# EAGLE design teensy_sid (EAGLE 8.1.0)
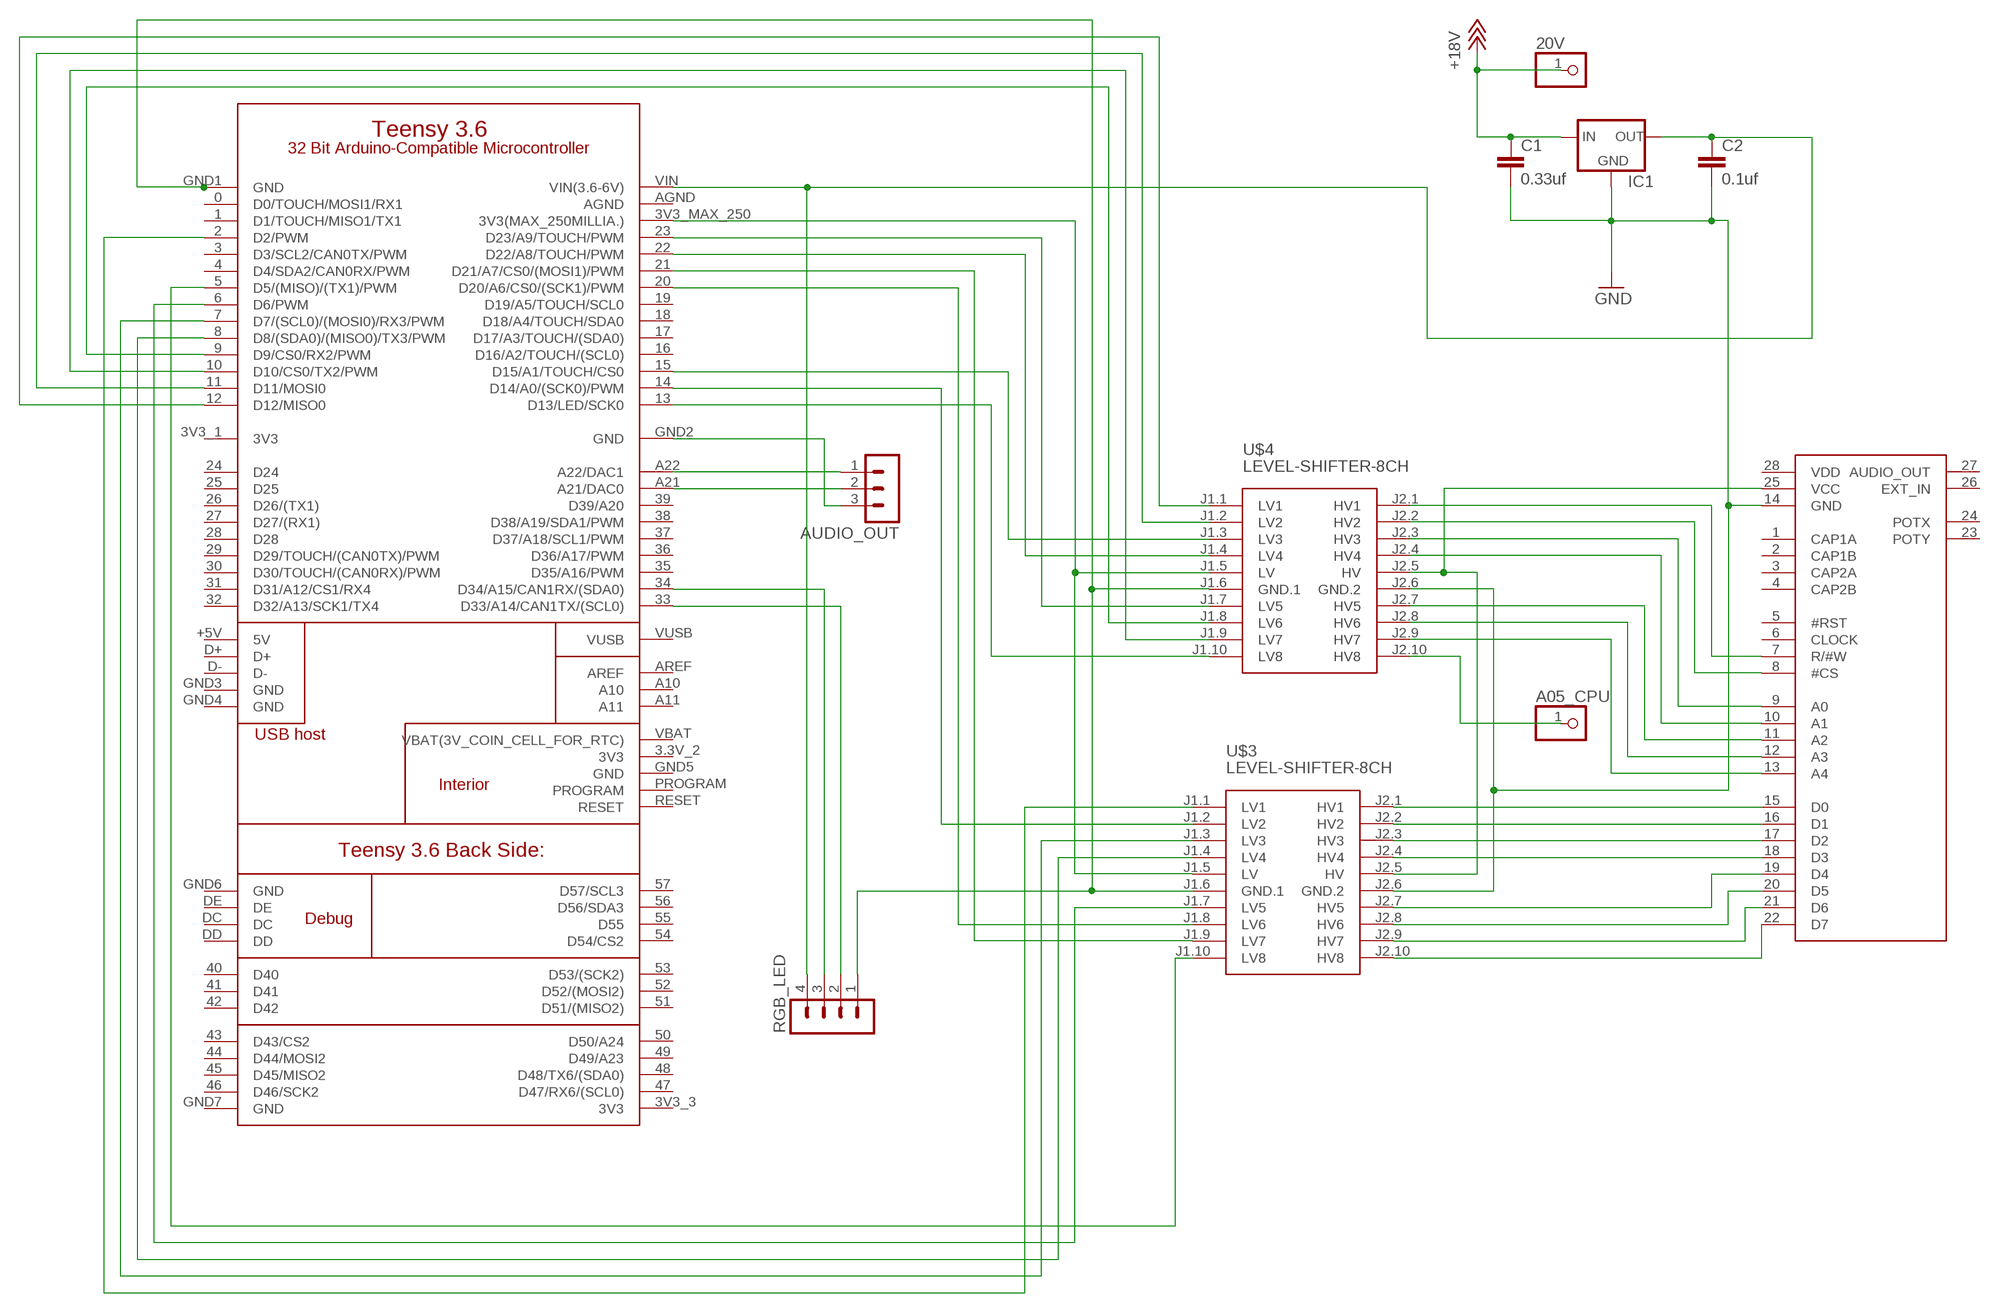
[diagram p0: schematic, sheet 1]

## Parts
20V  PINHD-1X1  [1X01]
A05_CPU  PINHD-1X1  [1X01]
AUDIO_OUT  MA03-1  [MA03-1]
C1  0.33uf  C-EU025-024X044  [C025-024X044]
C2  0.1uf  C-EU025-024X044  [C025-024X044]
IC1  78XXL  [78XXL]
RGB_LED  MA04-1  [MA04-1]
U$1  SID_6581  [DIL28-6]
U$2  TEENSY-3.6_FULL  [TEENSY-3.6_FULL]
U$3  LEVEL-SHIFTER-8CH  [LEVEL-SHIFTER-8CH]
U$4  LEVEL-SHIFTER-8CH  [LEVEL-SHIFTER-8CH]

## Nets
+18V: 20V.1 C1.1 IC1.IN
A0: U$1.9(A0) U$4.J2.3(HV3)
A1: U$1.10(A1) U$4.J2.4(HV4)
A2: U$1.11(A2) U$4.J2.7(HV5)
A3: U$1.12(A3) U$4.J2.8(HV6)
A4: U$1.13(A4) U$4.J2.9(HV7)
CS#: U$1.8(#CS) U$4.J2.2(HV2)
D0: U$1.15(D0) U$3.J2.1(HV1)
D1: U$1.16(D1) U$3.J2.2(HV2)
D2: U$1.17(D2) U$3.J2.3(HV3)
D3: U$1.18(D3) U$3.J2.4(HV4)
D4: U$1.19(D4) U$3.J2.7(HV5)
D5: U$1.20(D5) U$3.J2.8(HV6)
D6: U$1.21(D6) U$3.J2.9(HV7)
D7: U$1.22(D7) U$3.J2.10(HV8)
GND: C1.2 C2.2 IC1.GND U$1.14(GND) U$3.J2.6(GND.2) U$4.J2.6(GND.2)
N$1: U$2.12(D12/MISO0) U$4.J1.1(LV1)
N$2: U$2.11(D11/MOSI0) U$4.J1.2(LV2)
N$3: U$2.15(D15/A1/TOUCH/CS0) U$4.J1.3(LV3)
N$4: AUDIO_OUT.2 U$2.A21(A21/DAC0)
N$5: AUDIO_OUT.1 U$2.A22(A22/DAC1)
N$6: U$2.13(D13/LED/SCK0) U$4.J1.10(LV8)
N$7: U$2.9(D9/CS0/RX2/PWM) U$4.J1.8(LV6)
N$8: AUDIO_OUT.3 U$2.GND2(GND)
N$9: U$2.3V3_MAX_250(3V3(MAX_250MILLIA.)) U$3.J1.5(LV) U$4.J1.5(LV)
N$10: U$2.20(D20/A6/CS0/(SCK1)/PWM) U$3.J1.8(LV6)
N$12: U$2.21(D21/A7/CS0/(MOSI1)/PWM) U$3.J1.9(LV7)
N$13: U$2.2(D2/PWM) U$3.J1.1(LV1)
N$14: U$2.22(D22/A8/TOUCH/PWM) U$4.J1.4(LV4)
N$15: U$2.7(D7/(SCL0)/(MOSI0)/RX3/PWM) U$3.J1.3(LV3)
N$16: A05_CPU.1 U$4.J2.10(HV8)
N$17: U$2.8(D8/(SDA0)/(MISO0)/TX3/PWM) U$3.J1.4(LV4)
N$18: U$2.6(D6/PWM) U$3.J1.7(LV5)
N$19: C2.1 IC1.OUT RGB_LED.4 U$2.VIN(VIN(3.6-6V))
N$20: U$2.5(D5/(MISO)/(TX1)/PWM) U$3.J1.10(LV8)
N$21: U$1.25(VCC) U$3.J2.5(HV) U$4.J2.5(HV)
N$22: RGB_LED.1 U$2.GND1(GND) U$3.J1.6(GND.1) U$4.J1.6(GND.1)
N$25: U$2.14(D14/A0/(SCK0)/PWM) U$3.J1.2(LV2)
N$26: U$2.23(D23/A9/TOUCH/PWM) U$4.J1.7(LV5)
N$27: U$2.10(D10/CS0/TX2/PWM) U$4.J1.9(LV7)
N$31: RGB_LED.3 U$2.34(D34/A15/CAN1RX/(SDA0))
N$32: RGB_LED.2 U$2.33(D33/A14/CAN1TX/(SCL0))
RW#: U$1.7(R/#W) U$4.J2.1(HV1)
Unconnected: U$1.1(CAP1A) U$1.2(CAP1B) U$1.3(CAP2A) U$1.4(CAP2B) U$1.5(#RST) U$1.6(CLOCK) U$1.23(POTY) U$1.24(POTX) U$1.26(EXT_IN) U$1.27(AUDIO_OUT) U$1.28(VDD) U$2.0(D0/TOUCH/MOSI1/RX1) U$2.1(D1/TOUCH/MISO1/TX1) U$2.3(D3/SCL2/CAN0TX/PWM) U$2.3.3V_2(3V3) U$2.3V3_3(3V3) U$2.4(D4/SDA2/CAN0RX/PWM) U$2.16(D16/A2/TOUCH/(SCL0)) U$2.17(D17/A3/TOUCH/(SDA0)) U$2.18(D18/A4/TOUCH/SDA0) U$2.19(D19/A5/TOUCH/SCL0) U$2.24(D24) U$2.25(D25) U$2.26(D26/(TX1)) U$2.27(D27/(RX1)) U$2.28(D28) U$2.29(D29/TOUCH/(CAN0TX)/PWM) U$2.30(D30/TOUCH/(CAN0RX)/PWM) U$2.31(D31/A12/CS1/RX4) U$2.32(D32/A13/SCK1/TX4) U$2.35(D35/A16/PWM) U$2.36(D36/A17/PWM) U$2.37(D37/A18/SCL1/PWM) U$2.38(D38/A19/SDA1/PWM) U$2.39(D39/A20) U$2.40(D40) U$2.41(D41) U$2.42(D42) U$2.43(D43/CS2) U$2.44(D44/MOSI2) U$2.45(D45/MISO2) U$2.46(D46/SCK2) U$2.47(D47/RX6/(SCL0)) U$2.48(D48/TX6/(SDA0)) U$2.49(D49/A23) U$2.50(D50/A24) U$2.51(D51/(MISO2)) U$2.52(D52/(MOSI2)) U$2.53(D53/(SCK2)) U$2.54(D54/CS2) U$2.55(D55) U$2.56(D56/SDA3) U$2.57(D57/SCL3) U$2.+5V(5V) U$2.A10 U$2.A11 U$2.AREF U$2.D+ U$2.D- U$2.DC U$2.DD U$2.DE U$2.GND3(GND) U$2.GND4(GND) U$2.GND5(GND) U$2.GND6(GND) U$2.GND7(GND) U$2.PROGRAM U$2.RESET U$2.VBAT(VBAT(3V_COIN_CELL_FOR_RTC)) U$2.VUSB

## Power pins joined to a net without a drawn wire
3V3: U$2.3V3_1(3V3)
AGND: U$2.AGND

## Library data of the parts
20V A05_CPU = pinhead:PINHD-1X1: PIN HEADER
AUDIO_OUT = con-lstb:MA03-1: PIN HEADER; OC_FARNELL: unknown; OC_NEWARK: unknown
C1 C2 = resistor:C-EU: CAPACITOR, European symbol
IC1 = v-reg:78XXL: VOLTAGE REGULATOR
RGB_LED = con-lstb:MA04-1: PIN HEADER; OC_FARNELL: unknown; OC_NEWARK: unknown
U$1 = 6581-sid:SID_6581
U$2 = Teensy-3.6:TEENSY-3.6_FULL
U$3 U$4 = diy-modules:LEVEL-SHIFTER-8CH: 8-Channel Bi-Directional Logic Level Converter based on BSS128 transistors Click here to find device on ebay.com <http://www.ebay.com/sch/8+channel+level+converter> Note: There are many variants. Search for the proper version.

## Net classes
0 default: clearance 0.205 mm

## Board
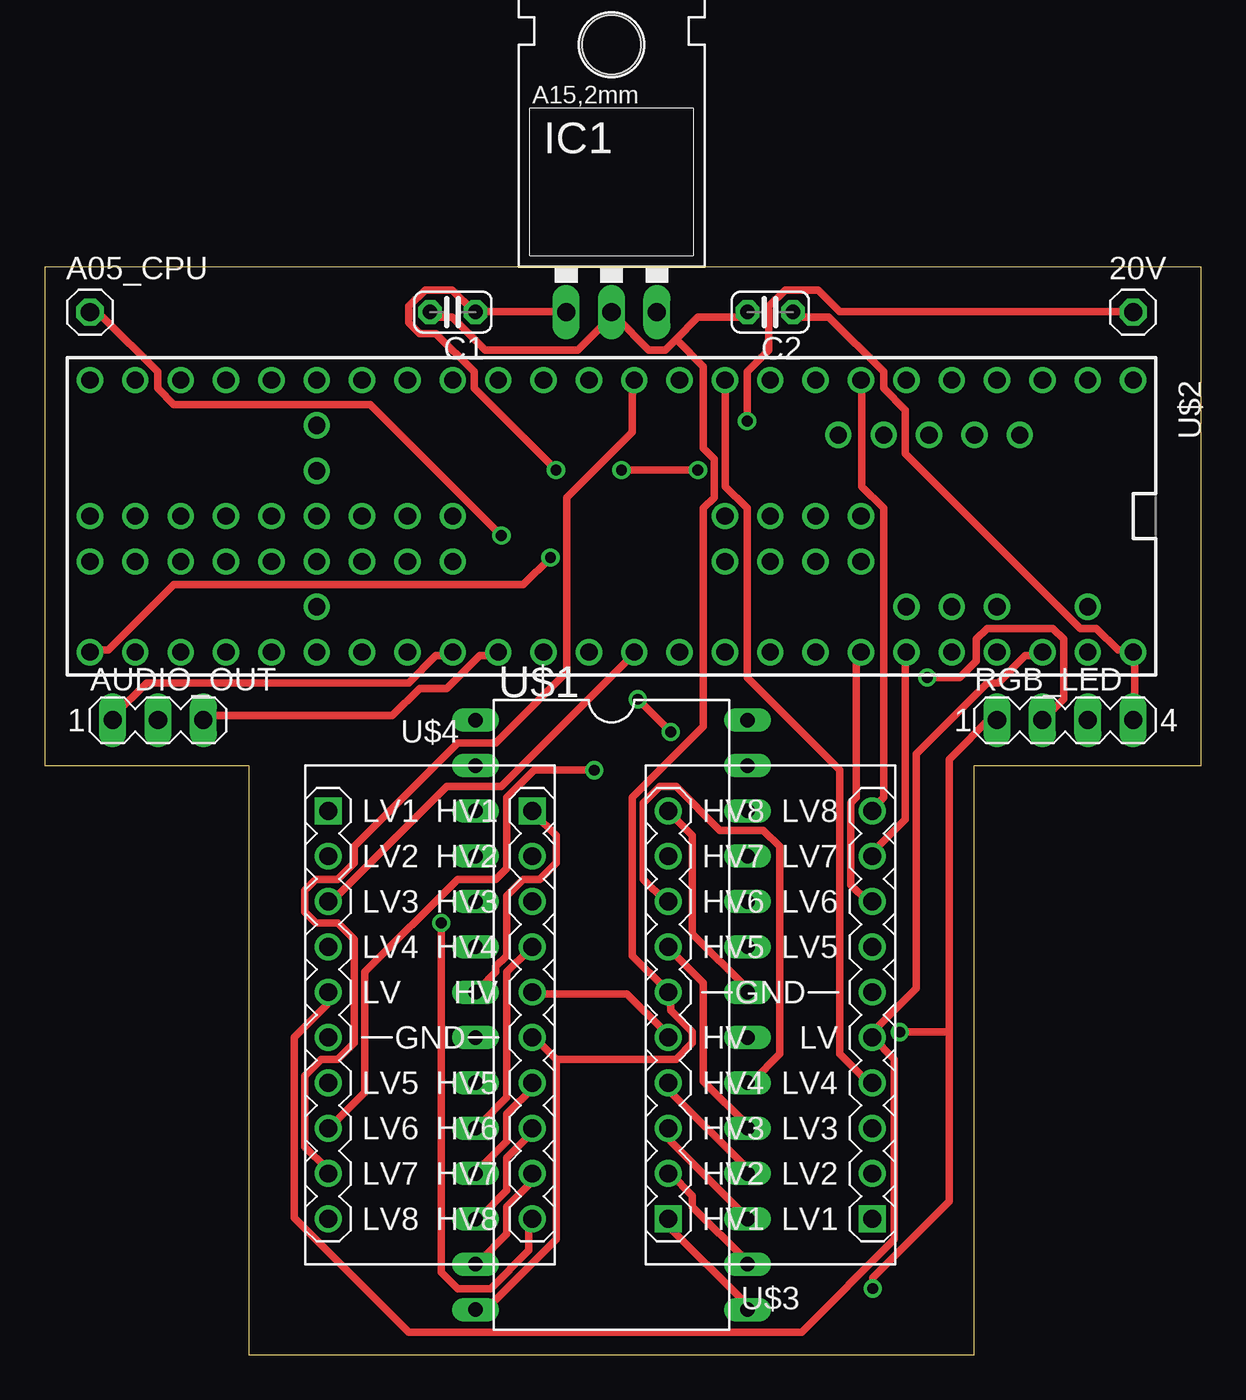
[diagram p1: board, top side]
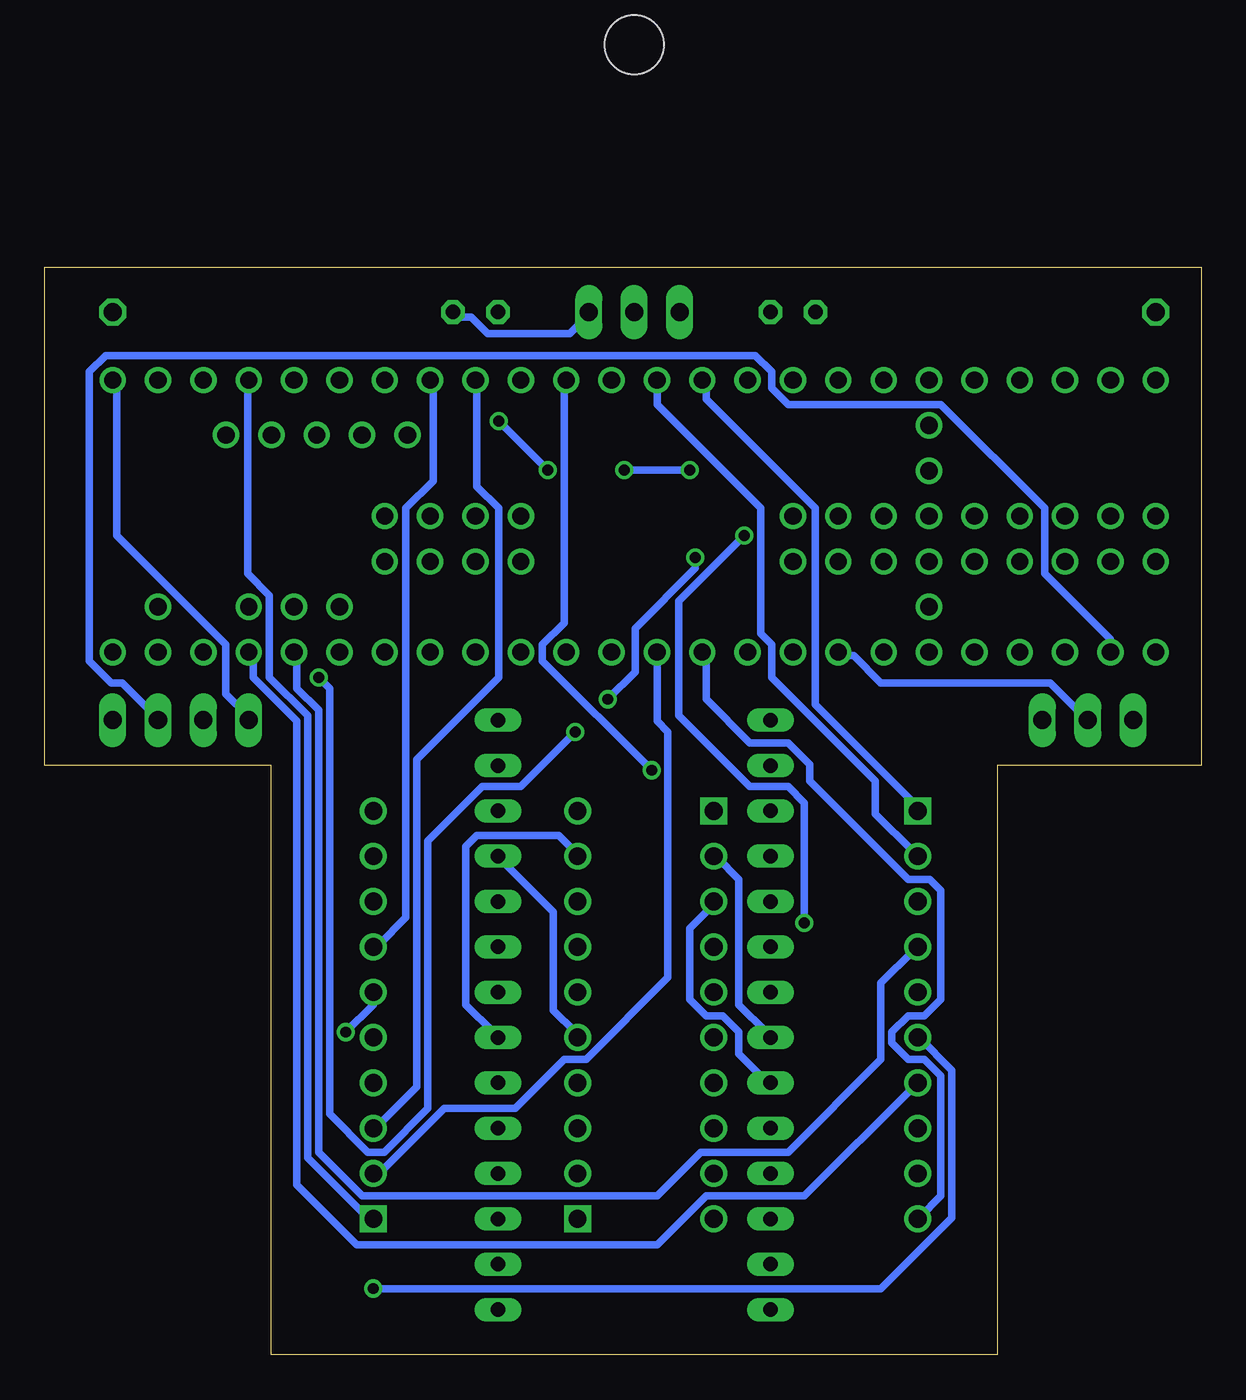
[diagram p2: board, bottom side, seen from below]

Size 64.77 x 60.95 mm. Coordinates in mm from the lower left corner, seen from the top.
Outline: 11.43,0 52.07,0 52.07,33.02 64.77,33.02 64.77,60.95 0,60.95 0,33.02 11.43,33.02 11.43,0
Copper layers (1*16): Top 0.035mm / dielectric 1.5mm / Bottom 0.035mm
Design rules "default *": minimum track width 16mil, minimum drill 24mil, track to track 8mil, track to pad 8mil, pad to pad 8mil, via to via 8mil, smd to smd 8mil, copper to edge 40mil, drill to drill 8mil, minimum pad ring 10mil, minimum via ring 8mil, stop-mask expansion 4mil, vias tented up to drill 0mil, thermal gap 10mil

### Footprints (pad centres in the part's own frame; a part is rotated, then mirrored left to right if it is on the bottom)
1X01 = drill 1.016 octagon: 1 0,0
MA03-1 = drill 1.016 long: 1 -2.54,0; 2 0,0; 3 2.54,0
C025-024X044 = drill 0.813 octagon: 1 -1.27,0; 2 1.27,0
78XXL = drill 1.016 long: GND 0,-3.81; IN -2.54,-3.81; OUT 2.54,-3.81 | hole 3.302: 0,11.176
MA04-1 = drill 1.016 long: 1 -3.81,0; 2 -1.27,0; 3 1.27,0; 4 3.81,0
DIL28-6 = drill 0.813 long: 1 -16.51,-7.62; 2 -13.97,-7.62; 3 -11.43,-7.62; 4 -8.89,-7.62; 5 -6.35,-7.62; 6 -3.81,-7.62; 7 -1.27,-7.62; 8 1.27,-7.62; 9 3.81,-7.62; 10 6.35,-7.62; 11 8.89,-7.62; 12 11.43,-7.62; 13 13.97,-7.62; 14 16.51,-7.62; 15 16.51,7.62; 16 13.97,7.62; 17 11.43,7.62; 18 8.89,7.62; 19 6.35,7.62; 20 3.81,7.62; 21 1.27,7.62; 22 -1.27,7.62; 23 -3.81,7.62; 24 -6.35,7.62; 25 -8.89,7.62; 26 -11.43,7.62; 27 -13.97,7.62; 28 -16.51,7.62
TEENSY-3.6_FULL = drill 0.965: 0 -7.62,5.08; 1 -7.62,2.54; 2 -7.62,0; 3 -7.62,-2.54; 3.3V_2 -2.54,-38.1; 3V3_1 -7.62,-27.94; 3V3_3 2.54,-50.8; 3V3_MAX_250 7.62,2.54; 4 -7.62,-5.08; 5 -7.62,-7.62; 6 -7.62,-10.16; 7 -7.62,-12.7; 8 -7.62,-15.24; 9 -7.62,-17.78; 10 -7.62,-20.32; 11 -7.62,-22.86; 12 -7.62,-25.4; 13 7.62,-25.4; 14 7.62,-22.86; 15 7.62,-20.32; 16 7.62,-17.78; 17 7.62,-15.24; 18 7.62,-12.7; 19 7.62,-10.16; 20 7.62,-7.62; 21 7.62,-5.08; 22 7.62,-2.54; 23 7.62,0; 24 -7.62,-30.48; 25 -7.62,-33.02; 26 -7.62,-35.56; 27 -7.62,-38.1; 28 -7.62,-40.64; 29 -7.62,-43.18; 30 -7.62,-45.72; 31 -7.62,-48.26; 32 -7.62,-50.8; 33 7.62,-50.8; 34 7.62,-48.26; 35 7.62,-45.72; 36 7.62,-43.18; 37 7.62,-40.64; 38 7.62,-38.1; 39 7.62,-35.56; 40 0,-30.48; 41 0,-33.02; 42 0,-35.56; 43 0,-40.64; 44 0,-43.18; 45 0,-45.72; 46 0,-48.26; 47 2.54,-48.26; 48 2.54,-45.72; 49 2.54,-43.18; 50 2.54,-40.64; 51 2.54,-35.56; 52 2.54,-33.02; 53 2.54,-30.48; 54 2.54,-15.24; 55 2.54,-12.7; 56 2.54,-10.16; 57 2.54,-7.62; +5V -4.547,1.27; A10 5.08,-2.54; A11 5.08,-5.08; A21 7.62,-33.02; A22 7.62,-30.48; AGND 7.62,5.08; AREF 5.08,0; D+ -4.547,-3.81; D- -4.547,-1.27; DC 0,-12.7; DD 0,-15.24; DE 0,-10.16; GND1 -7.62,7.62; GND2 7.62,-27.94; GND3 -4.547,-6.35; GND4 -4.547,-8.89; GND5 0,-38.1; GND6 0,-7.62; GND7 0,-50.8; PROGRAM 2.54,-38.1; RESET 5.08,-38.1; VBAT -5.08,-38.1; VIN 7.62,7.62; VUSB 5.08,5.08
LEVEL-SHIFTER-8CH = drill 1 square: J1.1 -5.715,11.43; J2.1 5.715,11.43 | drill 1: J1.2 -5.715,8.89; J1.3 -5.715,6.35; J1.4 -5.715,3.81; J1.5 -5.715,1.27; J1.6 -5.715,-1.27; J1.7 -5.715,-3.81; J1.8 -5.715,-6.35; J1.9 -5.715,-8.89; J1.10 -5.715,-11.43; J2.2 5.715,8.89; J2.3 5.715,6.35; J2.4 5.715,3.81; J2.5 5.715,1.27; J2.6 5.715,-1.27; J2.7 5.715,-3.81; J2.8 5.715,-6.35; J2.9 5.715,-8.89; J2.10 5.715,-11.43

### Placement (x,y rotation side)
20V  60.96,58.42 0 top
A05_CPU  2.54,58.42 0 top
AUDIO_OUT  6.35,35.56 0 top
C1  22.86,58.42 180 top
C2  40.64,58.42 180 top
IC1  31.75,62.23 0 top
RGB_LED  57.15,35.56 0 top
U$1  31.75,19.05 270 top
U$2  53.34,46.99 270 top
U$3  40.64,19.05 180 top
U$4  21.59,19.05 0 top

### Tracks (layer width: path | path; a pad name or v marks a point on that pad's centre or on a via)
+18V  (via drill 0.61)
  Top 0.406: IC1.IN 28.94,58.44 24.36,58.44 C1.1 24.05,58.44 22.83,59.66 21.3,59.66 20.39,58.74 20.39,57.82 21,57.21 21.91,57.21 24.05,55.07 24.05,54.16 v28.64,49.57 | v39.34,52.32 39.34,55.07 40.56,56.3 40.56,58.74 41.48,59.66 43.31,59.66 44.54,58.44 60.74,58.44 20V.1 | v32.31,49.57 v36.59,49.57
  Bottom 0.406: v36.59,49.57 v39.34,52.32 | v28.64,49.57 v32.31,49.57
A0
  Bottom 0.406: U$1.9 24.36,15.33 25.89,16.86 25.89,18.08 26.8,19 27.72,19 28.64,19.92 28.64,23.89 27.42,25.11 U$4.J2.3
A1
  Top 0.406: U$1.10 24.36,12.89 25.89,14.41 25.89,21.45 27.11,22.67 U$4.J2.4
A2
  Top 0.406: U$1.11 24.36,10.44 25.89,11.97 25.89,13.5 27.42,15.03 U$4.J2.7
A3
  Top 0.406: U$1.12 24.36,7.69 25.89,9.22 25.89,11.05 27.42,12.58 U$4.J2.8
A4
  Top 0.406: U$1.13 24.36,5.24 25.89,6.77 25.89,8.3 27.11,9.52 27.11,10.13 U$4.J2.9
CS#
  Bottom 0.406: U$1.8 24.36,18.08 25.89,19.61 25.89,26.64 27.11,27.87 U$4.J2.2
D0
  Top 0.406: U$1.15 39.34,2.8 34.75,7.38 U$3.J2.1
D1
  Top 0.406: U$1.16 39.34,5.24 36.28,8.3 36.28,8.91 35.06,10.13 U$3.J2.2
D2
  Top 0.406: U$1.17 39.34,7.69 35.06,11.97 35.06,12.58 U$3.J2.3
D3
  Top 0.406: U$1.18 39.34,10.44 34.75,15.03 U$3.J2.4
D4
  Top 0.406: U$1.19 39.34,12.89 36.89,15.33 36.89,20.84 35.06,22.67 U$3.J2.7
D5
  Top 0.406: U$1.20 39.64,15.33 41.17,16.86 41.17,28.48 40.26,29.39 37.81,29.39 35.36,31.84 34.45,31.84 33.53,30.92 33.53,26.64 34.75,25.42 U$3.J2.8
D6
  Bottom 0.406: U$1.21 39.64,18.08 41.17,19.61 41.17,28.48 40.56,29.09 35.98,29.09 35.06,28.17 U$3.J2.9
D7
  Top 0.406: U$1.22 39.34,20.53 36.28,23.59 36.28,29.09 35.06,30.31 U$3.J2.10
GND
  Top 0.406: C1.2 21.61,58.13 22.83,58.13 24.67,56.3 29.86,56.3 31.7,58.13 IC1.GND 32,58.13 33.84,56.3 34.75,56.3 35.36,56.91 | 35.36,56.91 36.59,58.13 39.34,58.13 C2.2 | 28.64,16.55 28.64,6.47 24.97,2.8 24.36,2.8 U$1.14 | 28.64,16.55 27.42,17.78 U$4.J2.6 | 28.64,16.55 35.36,16.55 36.28,17.47 36.28,18.08 35.06,19.31 35.06,20.22 U$3.J2.6 34.75,20.53 32.92,22.36 32.92,31.23 36.89,35.2 36.89,47.43 37.5,48.04 37.5,50.18 36.89,50.79 36.89,55.38 35.36,56.91
N$1
  Bottom 0.406: U$2.12 27.72,54.46 27.72,53.55 21.61,47.43 21.61,36.43 15.8,30.62 U$4.J1.1
N$2
  Bottom 0.406: U$2.11 30.47,54.46 30.47,53.24 24.67,47.43 24.67,40.4 24.05,39.79 24.05,37.95 18.25,32.15 18.25,30.31 16.11,28.17 U$4.J1.2
N$3
  Top 0.406: U$2.15 32.92,39.18 25.58,31.84 22.53,31.84 16.11,25.42 U$4.J1.3
N$4
  Bottom 0.406: U$2.A21 20.08,39.18 19.47,39.18 17.94,37.65 8.46,37.65 6.63,35.81 AUDIO_OUT.2
N$5
  Top 0.406: U$2.A22 22.83,39.18 21.91,39.18 20.39,37.65 5.71,37.65 3.88,35.81 AUDIO_OUT.1
N$6
  Bottom 0.406: U$2.13 27.72,39.18 27.72,36.73 25.28,34.29 23.14,34.29 21.91,33.06 21.91,32.15 16.41,26.64 15.19,26.64 14.58,26.03 14.58,19.92 15.49,19 16.41,19 17.33,18.08 17.33,17.47 16.41,16.55 15.49,16.55 14.58,15.64 14.58,8.91 15.8,7.69 U$4.J1.10
N$7  (via drill 0.61)
  Top 0.406: v30.78,32.76 27.42,32.76 25.89,31.23 25.89,27.25 25.28,26.64 23.14,26.64 17.94,21.45 17.94,14.72 16.11,12.89 U$4.J1.8
  Bottom 0.406: v30.78,32.76 36.89,38.87 36.89,39.79 35.67,41.01 35.67,54.46 U$2.9
N$8
  Top 0.406: U$2.GND2 25.28,39.18 24.36,39.18 22.53,37.34 21,37.34 19.47,35.81 9.07,35.81 AUDIO_OUT.3
N$9
  Top 0.406: U$2.3V3_MAX_250 55.85,39.18 54.93,39.18 53.4,37.65 52.79,37.65 48.81,33.67 48.81,20.53 46.37,18.08 U$3.J1.5 47.59,16.55 47.59,6.47 42.4,1.27 20.39,1.27 13.97,7.69 13.97,17.78 15.8,19.61 15.8,20.22 U$4.J1.5
N$10
  Top 0.406: U$2.20 45.45,39.18 45.45,31.23 45.15,30.92 45.15,26.34 46.06,25.42 U$3.J1.8
N$12
  Top 0.406: U$2.21 48.2,39.18 48.2,30.01 46.37,28.17 U$3.J1.9
N$13
  Bottom 0.406: U$2.2 53.4,54.46 53.4,43.76 52.18,42.54 52.18,37.95 50.04,35.81 50.04,11.05 46.37,7.38 U$3.J1.1
N$14
  Bottom 0.406: U$2.22 50.65,39.18 50.65,37.34 49.43,36.12 49.43,11.36 46.98,8.91 30.47,8.91 28.03,11.36 23.14,11.36 17.94,16.55 17.94,20.84 16.11,22.67 U$4.J1.4
N$15
  Bottom 0.406: U$2.7 40.56,54.46 40.56,48.65 39.34,47.43 39.34,37.95 43.92,33.37 43.92,15.03 46.06,12.89 U$3.J1.3
N$16  (via drill 0.61)
  Top 0.406: v22.22,24.2 22.22,4.63 23.14,3.72 24.97,3.72 27.11,5.86 27.11,7.38 U$4.J2.10 | v25.58,45.9 18.25,53.24 7.24,53.24 6.32,54.16 6.32,55.07 3.27,58.13 2.65,58.13 A05_CPU.1
  Bottom 0.406: v22.22,24.2 22.22,30.92 23.14,31.84 25.28,31.84 29.25,35.81 29.25,42.23 v25.58,45.9
N$17
  Top 0.406: U$2.8 38.12,54.46 38.12,48.65 39.34,47.43 39.34,37.95 44.54,32.76 44.54,16.86 46.06,15.33 U$3.J1.4
N$18
  Bottom 0.406: U$2.6 43.01,54.46 43.01,48.96 44.54,47.43 44.54,24.5 46.06,22.97 U$3.J1.7
N$19
  Top 0.406: RGB_LED.4 61.04,35.81 61.04,39.18 U$2.VIN 60.74,39.48 60.13,39.48 58.9,40.71 57.99,40.71 48.2,50.49 48.2,52.93 46.98,54.16 46.98,55.07 43.92,58.13 42.09,58.13 C2.1
  Bottom 0.406: C2.1 41.78,58.13 40.87,58.13 39.95,57.21 35.36,57.21 34.45,58.13 IC1.OUT
N$20
  Top 0.406: U$2.5 45.76,54.46 45.76,48.65 46.98,47.43 46.98,31.23 46.37,30.62 U$3.J1.10
N$21
  Top 0.406: U$4.J2.5 27.42,20.22 32.61,20.22 34.75,18.08 U$3.J2.5
  Bottom 0.406: U$1.25 39.34,27.87 36.28,24.81 36.28,19.31 35.06,18.08 U$3.J2.5
N$22  (via drill 0.61)
  Top 0.406: v46.37,3.72 46.37,4.33 50.65,8.61 50.65,18.08 | 50.65,18.08 50.65,33.37 53.09,35.81 RGB_LED.1 | 50.65,18.08 v47.9,18.08
  Bottom 0.406: U$2.GND1 60.74,54.46 60.74,45.9 54.62,39.79 54.62,37.04 53.4,35.81 RGB_LED.1 | v46.37,3.72 17.94,3.72 13.97,7.69 13.97,15.94 15.8,17.78 U$4.J1.6 | v47.9,18.08 46.37,19.61 46.37,20.22 U$3.J1.6
N$25
  Bottom 0.406: U$2.14 30.47,39.18 30.47,35.51 29.86,34.9 29.86,21.14 34.45,16.55 35.67,16.55 38.42,13.8 42.4,13.8 46.06,10.13 U$3.J1.2
N$26
  Bottom 0.406: U$2.23 53.09,39.18 53.09,37.95 50.65,35.51 50.65,9.52 47.29,6.16 30.47,6.16 27.72,8.91 22.22,8.91 16.11,15.03 U$4.J1.7
N$27
  Top 0.406: U$2.10 32.92,54.46 32.92,51.71 29.25,48.04 29.25,38.26 25.28,34.29 23.14,34.29 17.33,28.48 17.33,27.56 16.41,26.64 15.19,26.64 14.58,26.03 14.58,24.81 15.19,24.2 16.41,24.2 17.33,23.28 17.33,17.47 16.41,16.55 15.49,16.55 14.58,15.64 14.58,11.66 15.8,10.44 U$4.J1.9
N$31
  Bottom 0.406: U$2.34 5.1,39.48 5.1,40.09 8.77,43.76 8.77,47.43 14.58,53.24 23.14,53.24 24.05,54.16 24.05,55.07 24.97,55.99 61.35,55.99 62.27,55.07 62.27,38.87 61.04,37.65 60.43,37.65 58.6,35.81 RGB_LED.3
N$32  (via drill 0.61)
  Top 0.406: v28.33,44.68 26.8,43.15 7.24,43.15 3.57,39.48 2.65,39.48 U$2.33 | v35.06,34.9 v33.22,36.73 | v49.43,37.95 51.26,37.95 52.18,38.87 52.18,40.09 52.79,40.71 56.46,40.71 57.07,40.09 57.07,36.73 56.15,35.81 RGB_LED.2
  Bottom 0.406: v28.33,44.68 28.33,44.07 31.7,40.71 31.7,38.26 v33.22,36.73 | v35.06,34.9 38.12,31.84 40.26,31.84 43.31,28.78 43.31,13.8 45.76,11.36 46.67,11.36 48.81,13.5 48.81,37.34 v49.43,37.95
RW#
  Top 0.406: U$1.7 24.36,20.53 25.28,21.45 25.28,21.75 25.89,22.36 25.89,25.73 26.8,26.64 27.72,26.64 28.64,27.56 28.64,29.09 27.42,30.31 U$4.J2.1